# Altium schematic sheet IC_555_TIMER.SchDoc
size A4
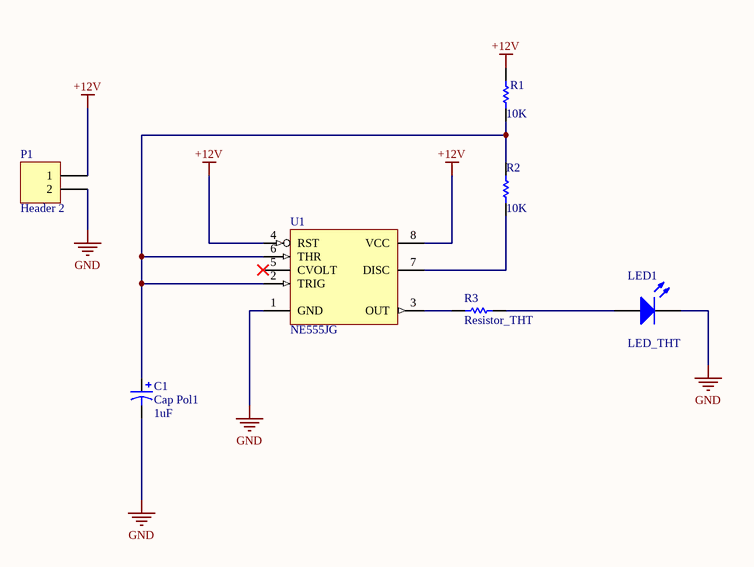
[diagram p0: IC_555_TIMER.SchDoc]

## Parts
C1  Cap Pol1  value 1uF  [RB7.6-15]
LED_THT  LED1  [LED-1]
P1  Header 2  [HDR1X2]
R1  value 10K  [AXIAL-0.3]  (hidden comment: G)
R2  value 10K  [AXIAL-0.3]  (hidden comment: Res1)
R3  Resistor_THT  [AXIAL-0.3]
U1  NE555JG  [JG008]

## Nets
+12V: P1.1 R1.2 U1.4(RST) U1.8(VCC)
GND: C1.2 LED_THT.2(K) P1.2 U1.1(GND)
NetC1_1: C1.1 R1.1 R2.1 U1.2(TRIG) U1.6(THR)
NetLED_THT_1: LED_THT.1(A) R3.2
NetR2_2: R2.2 U1.7(DISC)
NetR3_1: R3.1 U1.3(OUT)

Not connected (* = marked no-connect by the designer): U1 5(CVOLT)*

## Library data of the parts
C1 = Cap Pol1: Polarized Capacitor (Radial); Published: 8-Jun-2000; LatestRevisionDate: 17-Jul-2002; LatestRevisionNote: Re-released for DXP Platform.; PackageReference: RB7.6-15; Publisher: Altium Limited
LED_THT = LED1: Typical RED GaAs LED; Published: 8-Jun-2000; LatestRevisionDate: 08-Jul-2005; LatestRevisionNote: Mech Layer 1 removed.; PackageReference: LED-1; Publisher: Altium Limited
P1 = Header 2: Header, 2-Pin; LatestRevisionDate: 17-Jul-2002; LatestRevisionNote: Re-released for DXP Platform.; Publisher: Altium Limited
R1-R3 = Res1: Resistor; Published: 8-Jun-2000; LatestRevisionDate: 17-Jul-2002; LatestRevisionNote: Re-released for DXP Platform.; PackageReference: AXIAL-0.3; Publisher: Altium Limited
U1 = NE555JG: Precision Timer; Published: 16-Jan-2001; LatestRevisionDate: 04-Mar-2005; LatestRevisionNote: Stylized 3D Model Added.; DatasheetVersion: Feb-1992; PackageVersion: Jan-1995; PackageReference: JG008; Publisher: Altium Limited; PackageDescription: DIP; 8 Leads; Row Spacing 7.62 mm; Pitch 2.54 mm; ComponentLink1Description: Manufacturer Link; ComponentLink1URL: http://www.ti.com/; ComponentLink2Description: Datasheet; ComponentLink2URL: http://www-s.ti.com/sc/ds/ne555.pdf